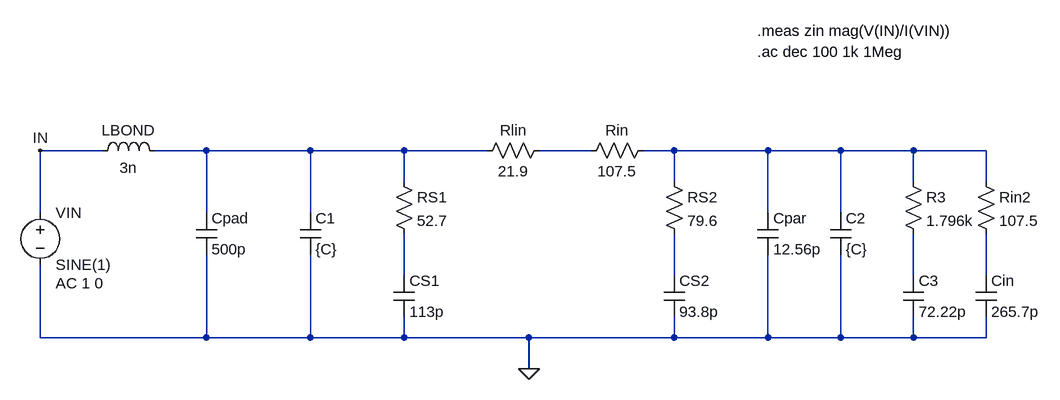
[diagram p0: schematic LNA.asc]
LNA.asc, the LTspice schematic file:
Version 4
SHEET 1 1516 680
WIRE 64 96 -32 96
WIRE 224 96 144 96
WIRE 384 96 224 96
WIRE 528 96 384 96
WIRE 656 96 528 96
WIRE 816 96 736 96
WIRE 944 96 896 96
WIRE 1088 96 944 96
WIRE 1200 96 1088 96
WIRE 1312 96 1200 96
WIRE 1424 96 1312 96
WIRE 528 144 528 96
WIRE 944 144 944 96
WIRE 1312 144 1312 96
WIRE 1424 144 1424 96
WIRE -32 192 -32 96
WIRE 224 192 224 96
WIRE 384 192 384 96
WIRE 1088 192 1088 96
WIRE 1200 192 1200 96
WIRE 528 288 528 224
WIRE 944 288 944 224
WIRE 1312 288 1312 224
WIRE 1424 288 1424 224
WIRE -32 384 -32 272
WIRE 224 384 224 256
WIRE 224 384 -32 384
WIRE 384 384 384 256
WIRE 384 384 224 384
WIRE 528 384 528 352
WIRE 528 384 384 384
WIRE 720 384 528 384
WIRE 944 384 944 352
WIRE 944 384 720 384
WIRE 1088 384 1088 256
WIRE 1088 384 944 384
WIRE 1200 384 1200 256
WIRE 1200 384 1088 384
WIRE 1312 384 1312 352
WIRE 1312 384 1200 384
WIRE 1424 384 1424 352
WIRE 1424 384 1312 384
WIRE 720 432 720 384
FLAG 720 432 0
FLAG -32 96 IN
SYMBOL ind 48 112 R270
WINDOW 0 32 56 VTop 2
WINDOW 3 5 56 VBottom 2
SYMATTR InstName LBOND
SYMATTR Value 3n
SYMBOL cap 208 192 R0
SYMATTR InstName Cpad
SYMATTR Value 500p
SYMBOL cap 368 192 R0
SYMATTR InstName C1
SYMATTR Value {C}
SYMBOL res 512 128 R0
SYMATTR InstName RS1
SYMATTR Value 52.7
SYMBOL cap 512 288 R0
SYMATTR InstName CS1
SYMATTR Value 113p
SYMBOL res 912 80 R90
WINDOW 0 0 56 VBottom 2
WINDOW 3 32 56 VTop 2
SYMATTR InstName Rin
SYMATTR Value 107.5
SYMBOL res 928 128 R0
SYMATTR InstName RS2
SYMATTR Value 79.6
SYMBOL cap 928 288 R0
SYMATTR InstName CS2
SYMATTR Value 93.8p
SYMBOL cap 1072 192 R0
SYMATTR InstName Cpar
SYMATTR Value 12.56p
SYMBOL cap 1184 192 R0
SYMATTR InstName C2
SYMATTR Value {C}
SYMBOL res 1296 128 R0
SYMATTR InstName R3
SYMATTR Value 1.796k
SYMBOL cap 1296 288 R0
SYMATTR InstName C3
SYMATTR Value 72.22p
SYMBOL res 1408 128 R0
SYMATTR InstName Rin2
SYMATTR Value 107.5
SYMBOL cap 1408 288 R0
SYMATTR InstName Cin
SYMATTR Value 265.7p
SYMBOL voltage -32 176 R0
WINDOW 123 24 124 Left 2
WINDOW 39 0 0 Left 0
SYMATTR Value2 AC 1 0
SYMATTR InstName VIN
SYMATTR Value SINE(1)
SYMBOL res 752 80 R90
WINDOW 0 0 56 VBottom 2
WINDOW 3 32 56 VTop 2
SYMATTR InstName Rlin
SYMATTR Value 21.9
TEXT 1072 -88 Left 2 !.meas zin mag(V(IN)/I(VIN))
TEXT 1072 -56 Left 2 !.ac dec 100 1k 1Meg

The netlist it stands for:
* LNA.asc
LBOND IN N001 3n
Cpad N001 0 500p
C1 N001 0 {C}
RS1 N001 N004 52.7
CS1 N004 0 113p
Rin N003 N002 107.5
RS2 N003 N005 79.6
CS2 N005 0 93.8p
Cpar N003 0 12.56p
C2 N003 0 {C}
R3 N003 N006 1.796k
C3 N006 0 72.22p
Rin2 N003 N007 107.5
Cin N007 0 265.7p
VIN IN 0 SINE(1) AC 1 0
Rlin N002 N001 21.9
.meas zin mag(V(IN)/I(VIN))
.ac dec 100 1k 1Meg
.backanno
.end